# EAGLE design power_divider (EAGLE 9.4.0)
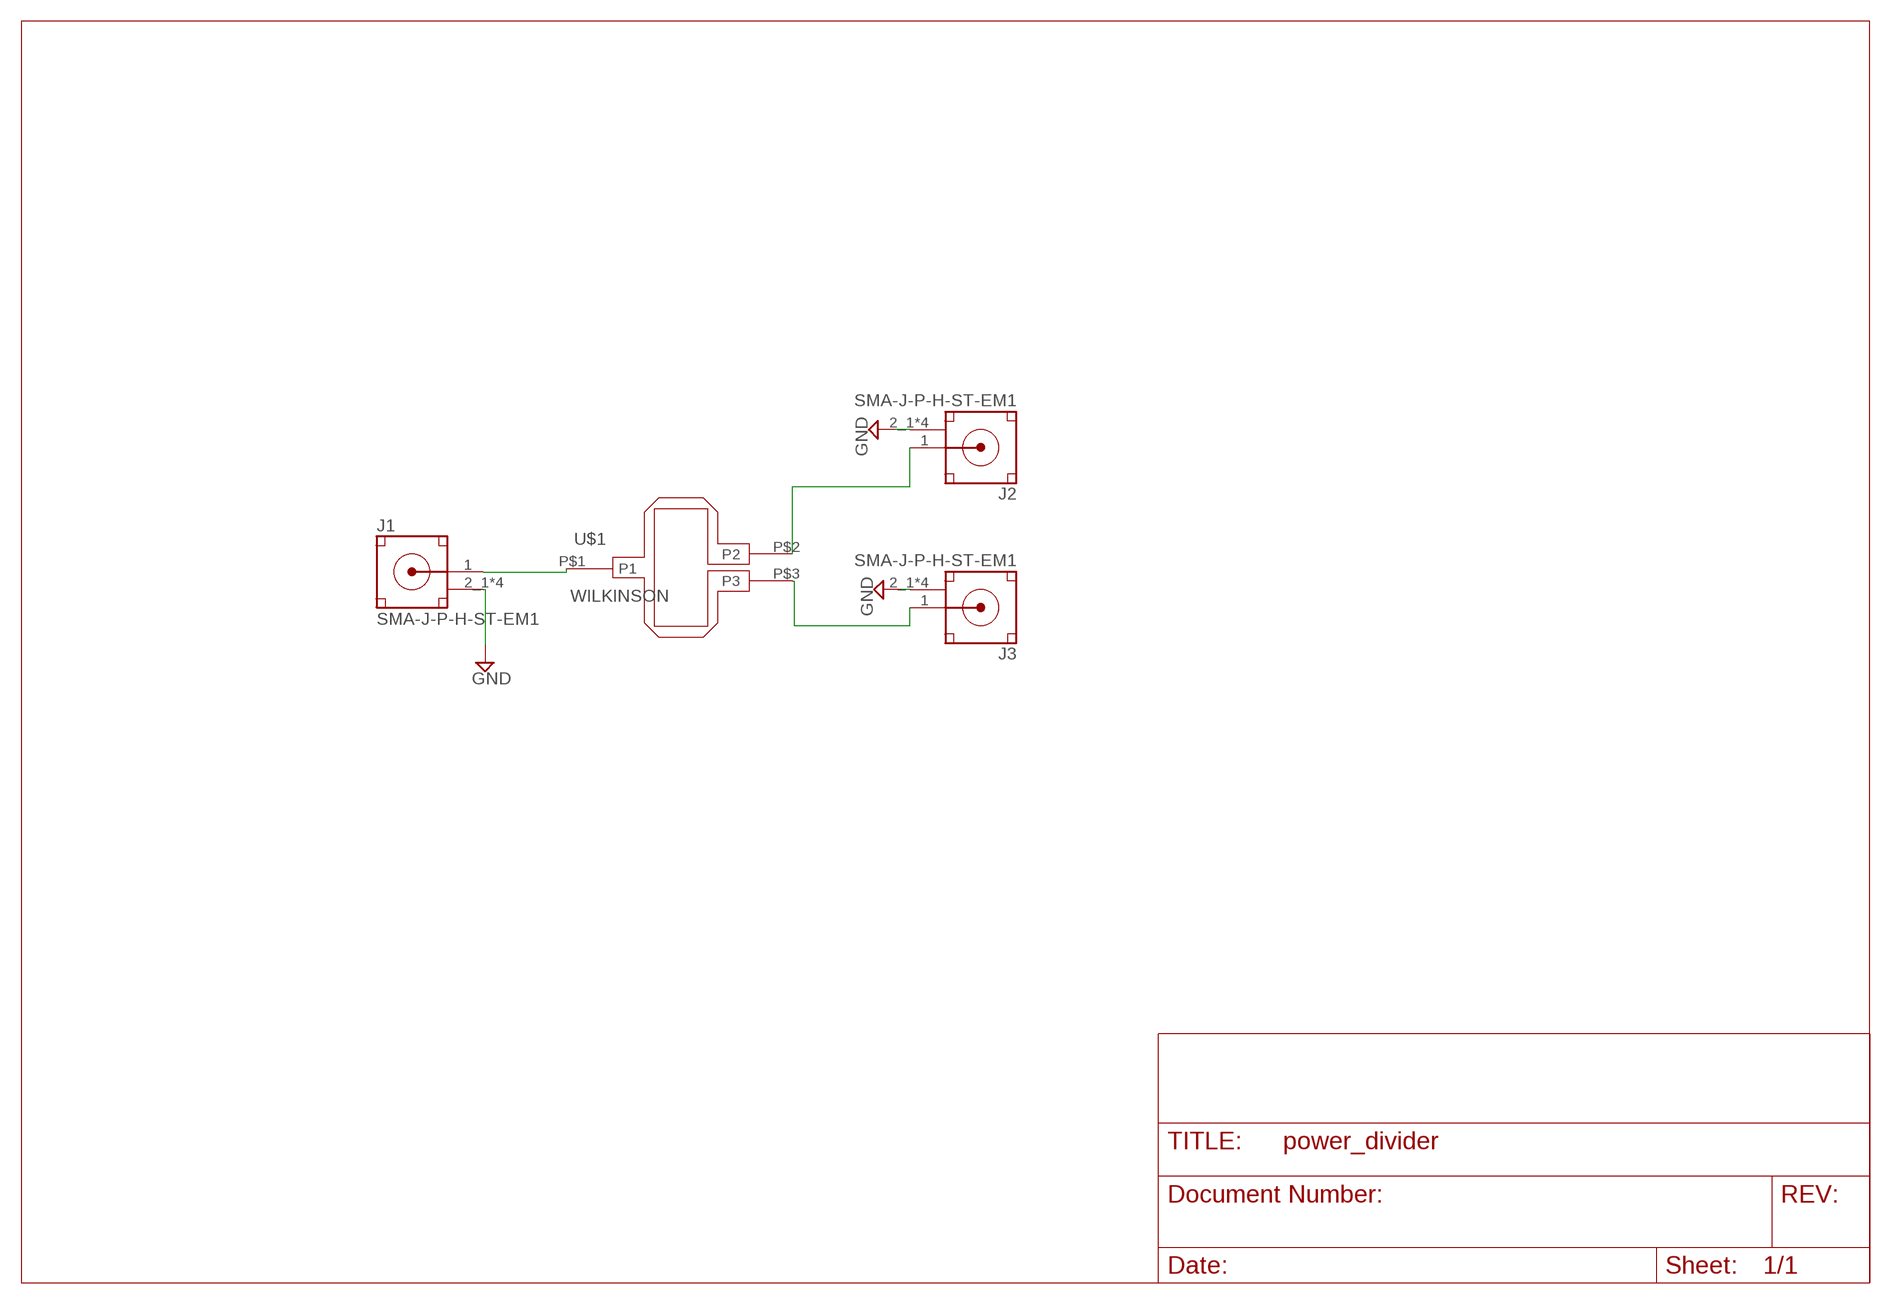
[diagram p0: schematic, sheet 1]

## Parts
J1  SMA-J-P-H-ST-EM1  [SMA-J-P-H-ST-EM1]
J2  SMA-J-P-H-ST-EM1  [SMA-J-P-H-ST-EM1]
J3  SMA-J-P-H-ST-EM1  [SMA-J-P-H-ST-EM1]
U$1  WILKINSON  [WILKINSON]

## Nets
GND: J1.2_1(GND) J1.2_2(GND) J1.3_1(GND) J1.3_2(GND) J2.2_1(GND) J2.2_2(GND) J2.3_1(GND) J2.3_2(GND) J3.2_1(GND) J3.2_2(GND) J3.3_1(GND) J3.3_2(GND)
N$1: J1.1(SIGNAL) U$1.P$1(P1)
N$2: J2.1(SIGNAL) U$1.P$2(P2)
N$3: J3.1(SIGNAL) U$1.P$3(P3)

## Library data of the parts
J1-J3 = SMA-J-P-H-ST-EM1:SMA-J-P-H-ST-EM1: Connector SMA F 50Ohm Solder ST Edge Mount Gold Over Nickel Tray; DESCRIPTION: Connector SMA F 50Ohm Solder ST Edge Mount Gold Over Nickel Tray; DIGI-KEY_PART_NUMBER: SAM8857-ND; DIGI-KEY_PURCHASE_URL: https://www.digikey.com/product-detail/en/samtec-inc/SMA-J-P-H-ST-EM1/SAM8857-ND/2602450?utm_source=snapeda&utm_medium=aggregator&utm_campaign=symbol; MF: Samtec; MP: SMA-J-P-H-ST-EM1; PACKAGE: None
U$1 = wilkinson:WILKINSON

## Board
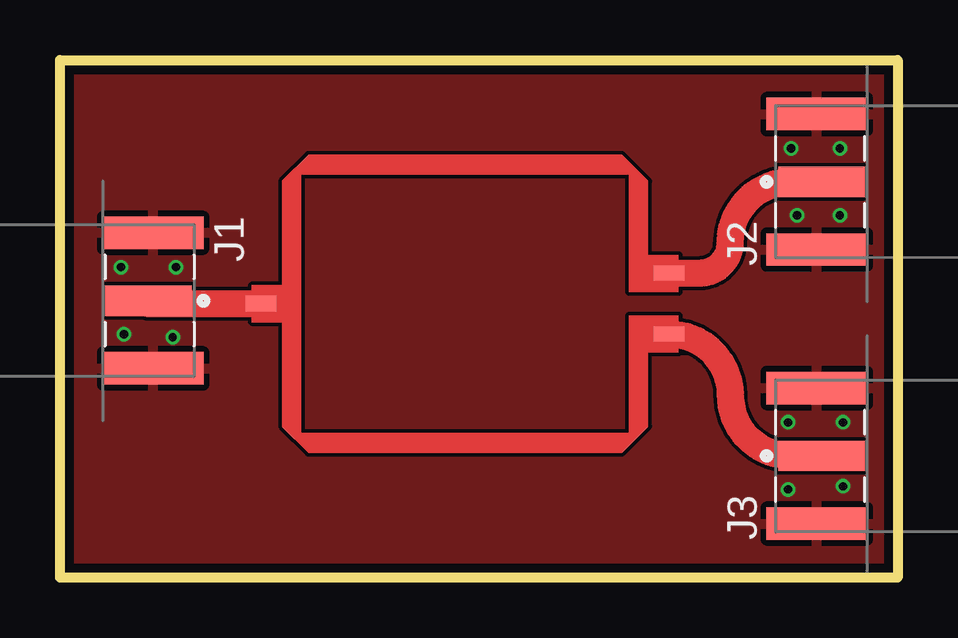
[diagram p1: board, top side]
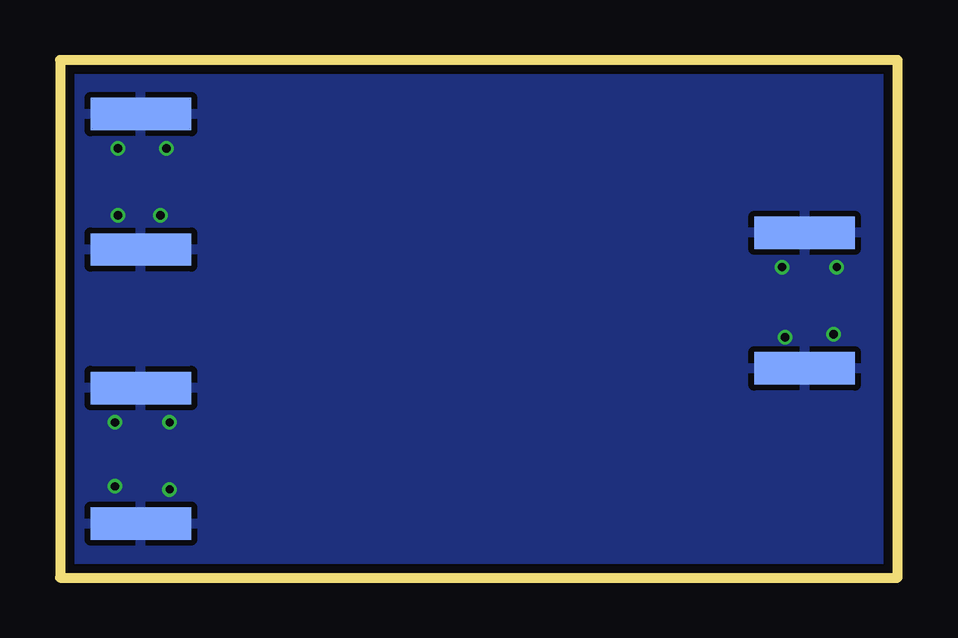
[diagram p2: board, bottom side, seen from below]

Size 34.92 x 21.59 mm. Coordinates in mm from the lower left corner, seen from the top.
Outline: 0,21.59 34.92,21.59 34.92,0 0,0 0,21.59
Copper layers (1*16): Top 0.035559375mm / dielectric 1.6mm / Bottom 0.035559375mm
Design rules "oshpark-2layer": minimum track width 6mil, minimum drill 10mil, track to track 6mil, track to pad 6mil, pad to pad 6mil, via to via 6mil, smd to smd 6mil, copper to edge 15mil, drill to drill 6mil, minimum pad ring 5mil, minimum via ring 5mil, stop-mask expansion 2.5mil, vias tented up to drill 0mil, thermal gap 10mil

### Footprints (pad centres in the part's own frame; a part is rotated, then mirrored left to right if it is on the bottom)
SMA-J-P-H-ST-EM1 = smd 1.27 x 3.6: 1 0,0 | smd 1.35 x 4.2: 2_1 -2.825,0.2; 3_1 2.825,0.2 | smd 1.35 x 4.2 bottom: 2_2 -2.825,0.2; 3_2 2.825,0.2
WILKINSON = smd 1.27 x 0.66: P$1 -6.858,0 | smd 1.27 x 0.635: P$2 10.16,1.27; P$3 10.16,-1.27

### Placement (x,y rotation side)
J1  3.68,11.56 270 top
J2  31.75,16.51 90 top
J3  31.75,5.08 90 top
U$1  15.24,11.43 0 top

### Tracks (layer width: path | path; a pad name or v marks a point on that pad's centre or on a via)
GND  (via drill 0.35)
  other vias: 2.67,10.16 30.35,6.48 30.73,15.11 32.64,3.81 32.64,6.48 30.35,3.68 32.51,17.91 30.48,17.91 32.51,15.11 4.83,12.95 4.7,10.03 2.54,12.95
  pour Top: 0,21.59 34.92,21.59 34.92,21.08 34.92,0 0,0
  pour Bottom: 0,21.59 35.05,21.59 35.05,0 34.54,0 0,0 0,0.13
N$1
  Top 1.118: J1.1 3.68,11.43 U$1.P$1
N$2
  Top 1.118: U$1.P$2 26.67,12.7 arc90 27.94,13.97 arc-90 30.48,16.51 J2.1
N$3
  Top 1.118: U$1.P$3 arc-90 27.94,7.62 arc90 30.48,5.08 J3.1